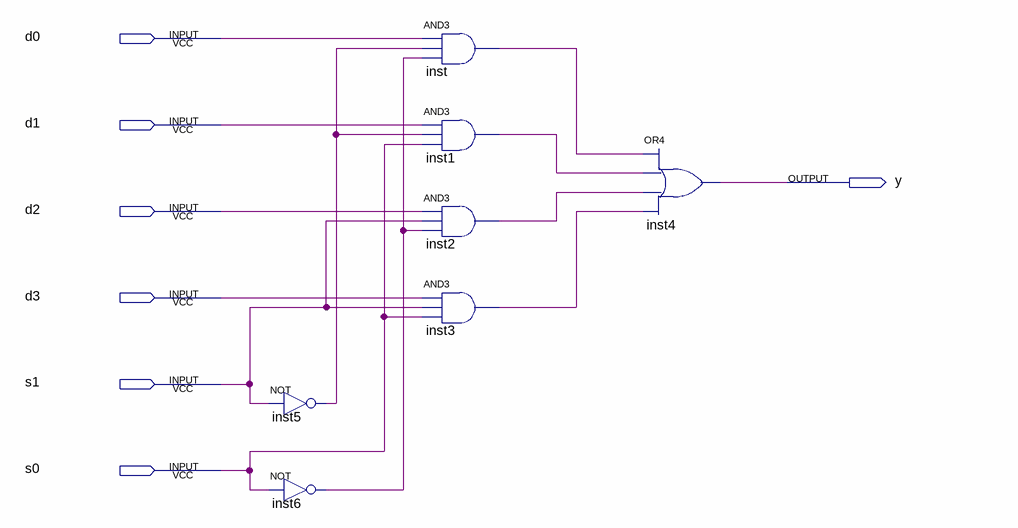
[diagram p0: schematic sheet]
// Quartus schematic mux4x1.bdf as structural Verilog: 7 symbols, 7 pins
module mux4x1 (
  input  d0,
  input  d1,
  input  d2,
  input  d3,
  input  s1,
  input  s0,
  output y
);

  wire inst1_out, inst2_out, inst3_out, inst5_out, inst6_out, inst_out;

  not inst5 (inst5_out, s1);
  not inst6 (inst6_out, s0);
  and inst (inst_out, d0, inst5_out, inst6_out);
  and inst1 (inst1_out, d1, inst5_out, s0);
  and inst2 (inst2_out, d2, s1, inst6_out);
  and inst3 (inst3_out, d3, s1, s0);
  or inst4 (y, inst_out, inst1_out, inst2_out, inst3_out);
endmodule
